# Altium schematic sheet Sheet1.SchDoc
size A3
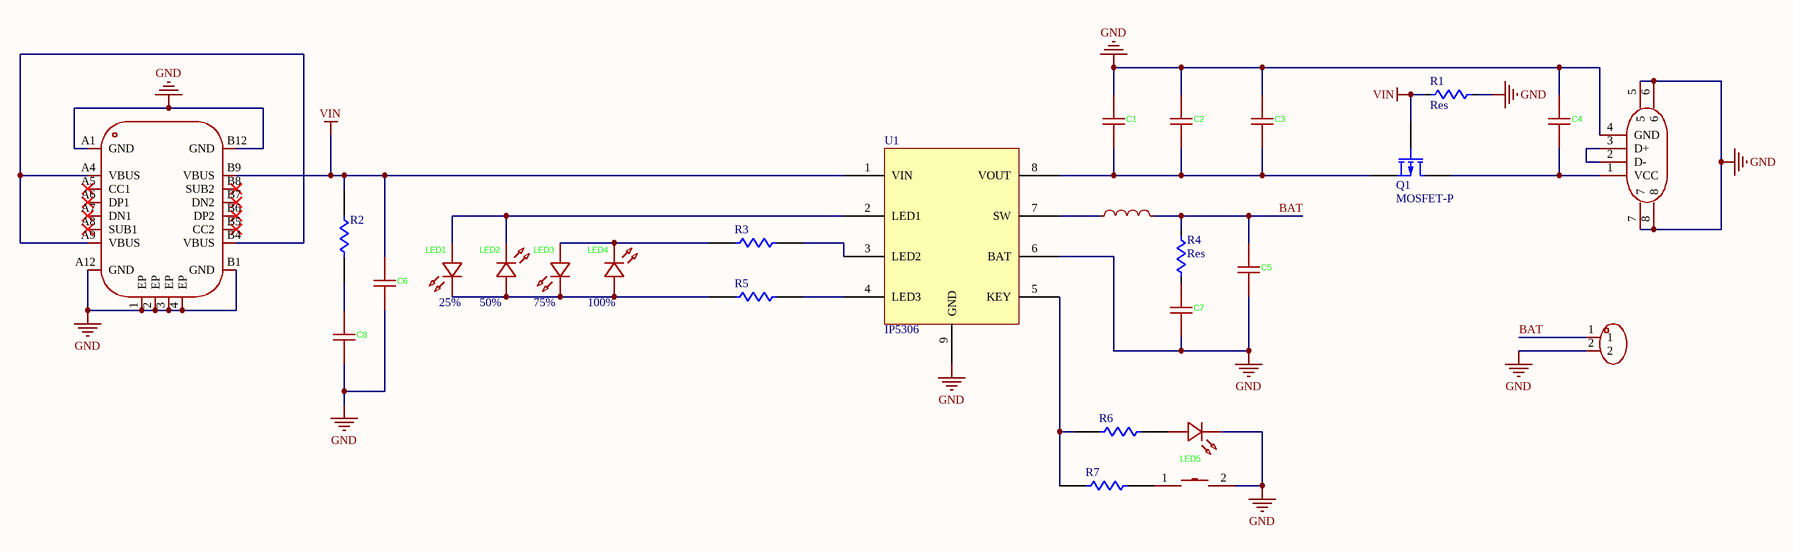
[diagram p0: Sheet1.SchDoc]

## Parts
C1  Capacitor_Patch  [C0805]  (value not drawn)
C2  Capacitor_Patch  [C0805]  (value not drawn)
C3  Capacitor_Patch  [C0805]  (value not drawn)
C4  Capacitor_Patch  [C0805]  (value not drawn)
C5  Capacitor_Patch  [C0805]  (value not drawn)
C6  Capacitor_Patch  [C0805]  (value not drawn)
C7  Capacitor_Patch  [C0805]  (value not drawn)
C8  Capacitor_Patch  [C0805]  (value not drawn)
CN1  HX25003-2WAP  [CONN-TH_2P-P2.50_HX25003-2WAP]  (value not drawn)
LED1  LED_Patch  [PCBComponent_1]  (value not drawn)
LED2  LED_Patch  [PCBComponent_1]  (value not drawn)
LED3  LED_Patch  [PCBComponent_1]  (value not drawn)
LED4  LED_Patch  [PCBComponent_1]  (value not drawn)
LED5  LED_Patch  [PCBComponent_1]  (value not drawn)
Q1  MOSFET-P  [SOT23_M]
R1  Res  [6-0805_N]
R2  Res  [6-0805_N]  (value not drawn)
R3  Res  [6-0805_N]  (value not drawn)
R4  Res  [6-0805_N]
R5  Res  [6-0805_N]  (value not drawn)
R6  Res  [6-0805_N]  (value not drawn)
R7  Res  [6-0805_N]  (value not drawn)
SW1  TS-1101-C-W  [SW-SMD_L6.0-W3.3-LS8.0]  (value not drawn)
U1  IP5306  [ESOP-8_L4.9-W3.9-P1.27-LS6.0-BL-EP]
U2  1uH  [IND-SMD_L4.4-W4.2]  (value not drawn)
USB1  10.0 QTJ6.3  [USB-A-SMD_10.0-QTJ6.3]  (value not drawn)
USB2  KH-TYPE-C-16P  [USB-C-SMD_KH-TYPE-C-16P]  (value not drawn)

## Nets
GND: C1.2 C2.2 C3.2 C4.2 C5.1 C6.1 C7.1 C8.1 CN1.2 LED5.1(K) R1.1 SW1.2 U1.6(BAT) U1.9(GND) USB1.4(GND) USB1.5 USB1.6 USB1.7 USB1.8 USB2.1(EP) USB2.2(EP) USB2.3(EP) USB2.4(EP) USB2.A1(GND) USB2.A12(GND) USB2.B1(GND) USB2.B12(GND)
VIN: C6.2 Q1.2(G) R1.2 R2.1 U1.1(VIN) USB2.B9(VBUS)
BAT: C5.2 CN1.1 R4.1 U2.2
NetC1_1: C1.1 C2.1 C3.1 Q1.3(S) U1.8(VOUT)
NetC4_1: C4.1 Q1.1(D) USB1.1(VCC)
NetC7_2: C7.2 R4.2
NetC8_2: C8.2 R2.2
NetLED1_1: LED1.1(K) LED2.2(A) LED3.1(K) LED4.2(A) R5.1
NetLED1_2: LED1.2(A) LED2.1(K) U1.2(LED1)
NetLED3_2: LED3.2(A) LED4.1(K) R3.1
NetLED5_2: LED5.2(A) R6.2
NetR3_2: R3.2 U1.3(LED2)
NetR5_2: R5.2 U1.4(LED3)
NetR6_1: R6.1 R7.1 U1.5(KEY)
NetR7_2: R7.2 SW1.1
NetU1_7: U1.7(SW) U2.1
NetUSB1_2: USB1.2(D-) USB1.3(D+)
NetUSB2_A4: USB2.A4(VBUS) USB2.A9(VBUS) USB2.B4(VBUS)

Not connected (* = marked no-connect by the designer): USB2 A5(CC1)* A6(DP1)* A7(DN1)* A8(SUB1)* B5(CC2)* B6(DP2)* B7(DN2)* B8(SUB2)*

## Notes on the sheet
- (near LED1) 25%
- (near LED2) 50%
- (near LED3) 75%
- (near LED4) 100%

## Library data of the parts
C1-C8 = Capacitor_Patch: 0805; Manufacturer: SAMSUNG(三星); Symbol: CL21A106KAYNNNE; Device: CL21A106KAYNNNE_C15850; Add into BOM: yes; Value: 10uF; Tolerance: ±10%; Voltage Rated: 25V; Temperature Coefficient: X5R; LCSC Part Name: 10uF ±10% 25V; Supplier Part: C15850; Manufacturer Part: CL21A106KAYNNNE; Supplier Footprint: 0805; JLCPCB Part Class: Basic Part; Datasheet: https://atta.szlcsc.com/upload/public/pdf/source/20160218/1457707763339.pdf; Supplier: LCSC; Convert to PCB: yes
CN1 = HX25003-2WAP: Manufacturer: HX(红星); Add into BOM: yes; Pins Structure: 1x2P; Pitch: 2.5mm; Reference Series: XH; Number of PINs Per Row: 2; Symbol: HX25003-2WAP; Device: HX25003-2WAP; LCSC Part Name: 1x2P 间距:2.5mm 弯插 系列:XH; Supplier Part: C442326; Manufacturer Part: HX25003-2WAP; Supplier Footprint: 弯插,P=2.5mm; JLCPCB Part Class: Extended Part; Datasheet: https://atta.szlcsc.com/upload/public/pdf/source/20191028/C442341_CB026E8ECE589085FA4A025D9CD8B44B.pdf; Supplier: LCSC; Convert to PCB: yes; Mounting Style: 弯插; Number of Pins: 2P; Number of Rows: 1; Row Spacing: -; Current Rating (Max): -; Operating Temperature Range: -
LED1-LED5 = LED_Patch: 0805; Manufacturer: XINGLIGHT(成兴光); Symbol: XL-2012UGC; Add into BOM: yes; Illumination Color: 翠绿色; Voltage - Forward(Vf): 3.2V; Power(Watts): 70mW; Forward Current: 20mA; Wavelength - Dominant: 515nm~535nm; Peak Wavelength: 525nm; Lens Color: 无色透明透镜; Luminous Intensity: 750mcd; Viewing Angle: 120°; Mounting Sytle: 正贴; Device: XL-2012UGC; LCSC Part Name: XL-2012UGC; Supplier Part: C965815; Manufacturer Part: XL-2012UGC; Supplier Footprint: 0805; JLCPCB Part Class: Extended Part; Datasheet: https://atta.szlcsc.com/upload/public/pdf/source/20250225/603248BA8F596867ADF5B11D7DFBCB79.pdf; Supplier: LCSC; Convert to PCB: yes; Color Temperature: -; Operating Temperature: -20℃~+85℃
Q1 = MOSFET-P: P-Channel MOSFET; pin to pad: 1>3 3>1; Published: 8-Jun-2000; LatestRevisionDate: 17-Jul-2002; LatestRevisionNote: Re-released for DXP Platform.; PackageVersion: 1995/1996; PackageReference: E3; Publisher: Altium Limited; PackageDescription: TO, Flat Index; 3 In-Line, Axial Leads; Body Dia. 4.6mm; Lead Dia. 0.5 mm (max)
SW1 = TS-1101-C-W: Manufacturer: XKB Connectivity(中国星坤); Add into BOM: yes; Circuit: 单刀单掷; Actuator Style: 矩形按钮; Operating Force: 260gf; Switch Length: 6mm; Switch Width: 3.6mm; Switch Height: 2.5mm; Strike Gundam: 不带; Contact Current: 50mA; Voltage Rating (DC): 12V; Actuator/Cap Color: 白色带淡绿; With Lamp: 无; Mechanical Life: 5万次; Symbol: TS-1101-C-W; Device: TS-1101-C-W; LCSC Part Name: 6*3.6*2.5mm 立贴 轻触开关; Supplier Part: C318938; Manufacturer Part: TS-1101-C-W; Supplier Footprint: SMD; JLCPCB Part Class: Extended Part; Datasheet: https://atta.szlcsc.com/upload/public/pdf/source/20200227/C318938_C2E53B1EEDE37D980A33616AC086DE53.pdf; Supplier: LCSC; Convert to PCB: yes; Mounting Style: 立贴; Voltage Rating (AC): -; Power Rating: -; Insulation Resistance: -; IP Rating: -; Pin Style: -; Operating Temperature: -30℃~+85℃
U1 = IP5306: IC
U2 = Inductor_SMD: Manufacturer: XR(祥如); Symbol: XR0420-1R0M; Add into BOM: yes; Tolerance: ±20%; Current Rating: 6A; Current - Saturation(Isat): 7A; DC Resistance(DCR): 27mΩ; Device: XR0420-1R0M; LCSC Part Name: 1uH ±20% 7A; Supplier Part: C5307587; Manufacturer Part: XR0420-1R0M; Supplier Footprint: SMD,0420; JLCPCB Part Class: Extended Part; Datasheet: https://atta.szlcsc.com/upload/public/pdf/source/20240328/238362994E593F0E82794C6287AEB16E.pdf; Supplier: LCSC; Convert to PCB: yes; Value: 1uH; Type: 一体成型电感
USB1 = 10.0 QTJ6.3: Manufacturer: SHOU HAN(首韩); Add into BOM: yes; Connector Type: Type-A; Gender: 母; Number of Contacts: 4P; Number of Ports: 1; Current Rating - Power (Max): 1.5A; Rated Voltage (Max): 30V; Connect-Disconnect Life: 5千次; Core Colour: 黑色; Symbol: 10.0 QTJ6.3; Device: 10.0 QTJ6.3; LCSC Part Name: Type-A 母 卧贴; Supplier Part: C404966; Manufacturer Part: 10.0 QTJ6.3; Supplier Footprint: SMD; JLCPCB Part Class: Extended Part; Datasheet: https://atta.szlcsc.com/upload/public/pdf/source/20241125/0CEA21D77C128715D5877707589FFAD8.pdf; Supplier: LCSC; Convert to PCB: yes; Standard: USB 2.0; Mounting Style: 卧贴; Supplementary Features: -; Center Height: -; Length: 10mm; Operating Temperature Range: -25℃~+85℃
USB2 = KH-TYPE-C-16P: Manufacturer: kinghelm(金航标); Add into BOM: yes; Connector Type: Type-C; Gender: 母; Number of Ports: 1; Number of Contacts: 16P; Current Rating - Power (Max): 3A; Symbol: KH-TYPE-C-16P; Device: KH-TYPE-C-16P; LCSC Part Name: Type-C 母 卧贴; Supplier Part: C709357; Manufacturer Part: KH-TYPE-C-16P; Supplier Footprint: SMD; JLCPCB Part Class: Extended Part; Datasheet: https://atta.szlcsc.com/upload/public/pdf/source/20200911/C709357_AA8DCEB38BB20E3035A7ED7AE7667837.pdf; Supplier: LCSC; Convert to PCB: yes; Standard: -; Mounting Style: 卧贴; Operating Temperature Range: -40℃~+85℃
R1-R7 = Res: Published: 24-Mar-1999; LatestRevisionDate: 29-May-2009; LatestRevisionNote: IPC-7351 Footprint Added.; PackageVersion: Mar-2003; PackageReference: 6-0805; Publisher: Altium Limited; PackageDescription: Chip Resistor 0805 Case Size; Code_IPC: RESC2012